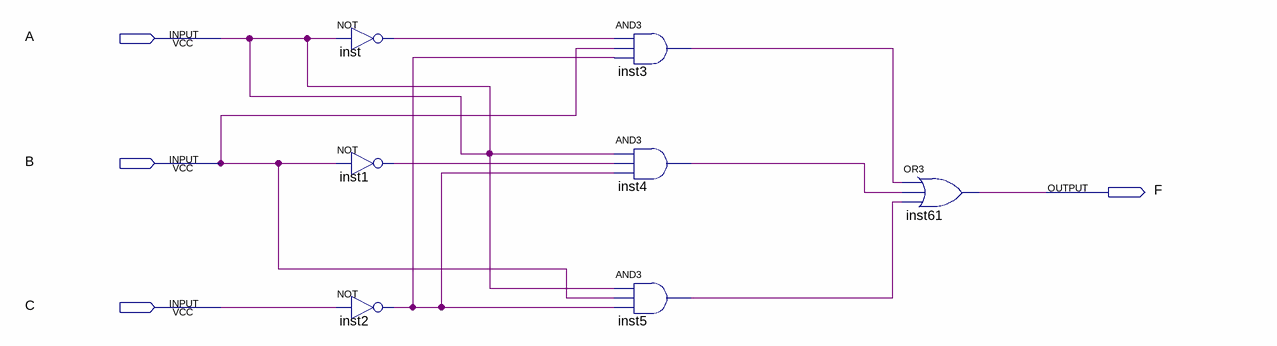
[diagram p0: schematic sheet]
// Quartus schematic lab2step1.bdf as structural Verilog: 7 symbols, 4 pins
module lab2step1 (
  input  A,
  input  B,
  input  C,
  output F
);

  wire inst1_out, inst2_out, inst3_out, inst4_out, inst5_out, inst_out;

  not inst (inst_out, A);
  not inst1 (inst1_out, B);
  not inst2 (inst2_out, C);
  and inst3 (inst3_out, inst_out, B, inst2_out);
  and inst4 (inst4_out, A, inst1_out, inst2_out);
  and inst5 (inst5_out, A, B, inst2_out);
  or inst61 (F, inst3_out, inst4_out, inst5_out);
endmodule
